# Altium schematic sheet 2-Supplies.SchDoc
size 420 x 297 mm; CompanyName: Microchip Technology Inc.; Organization: Microchip Technology; Address1: 2355 West Chandler Blvd.; Address2: Chandler, AZ  85224; Address4: USA; SheetTitle: **; Time: Time
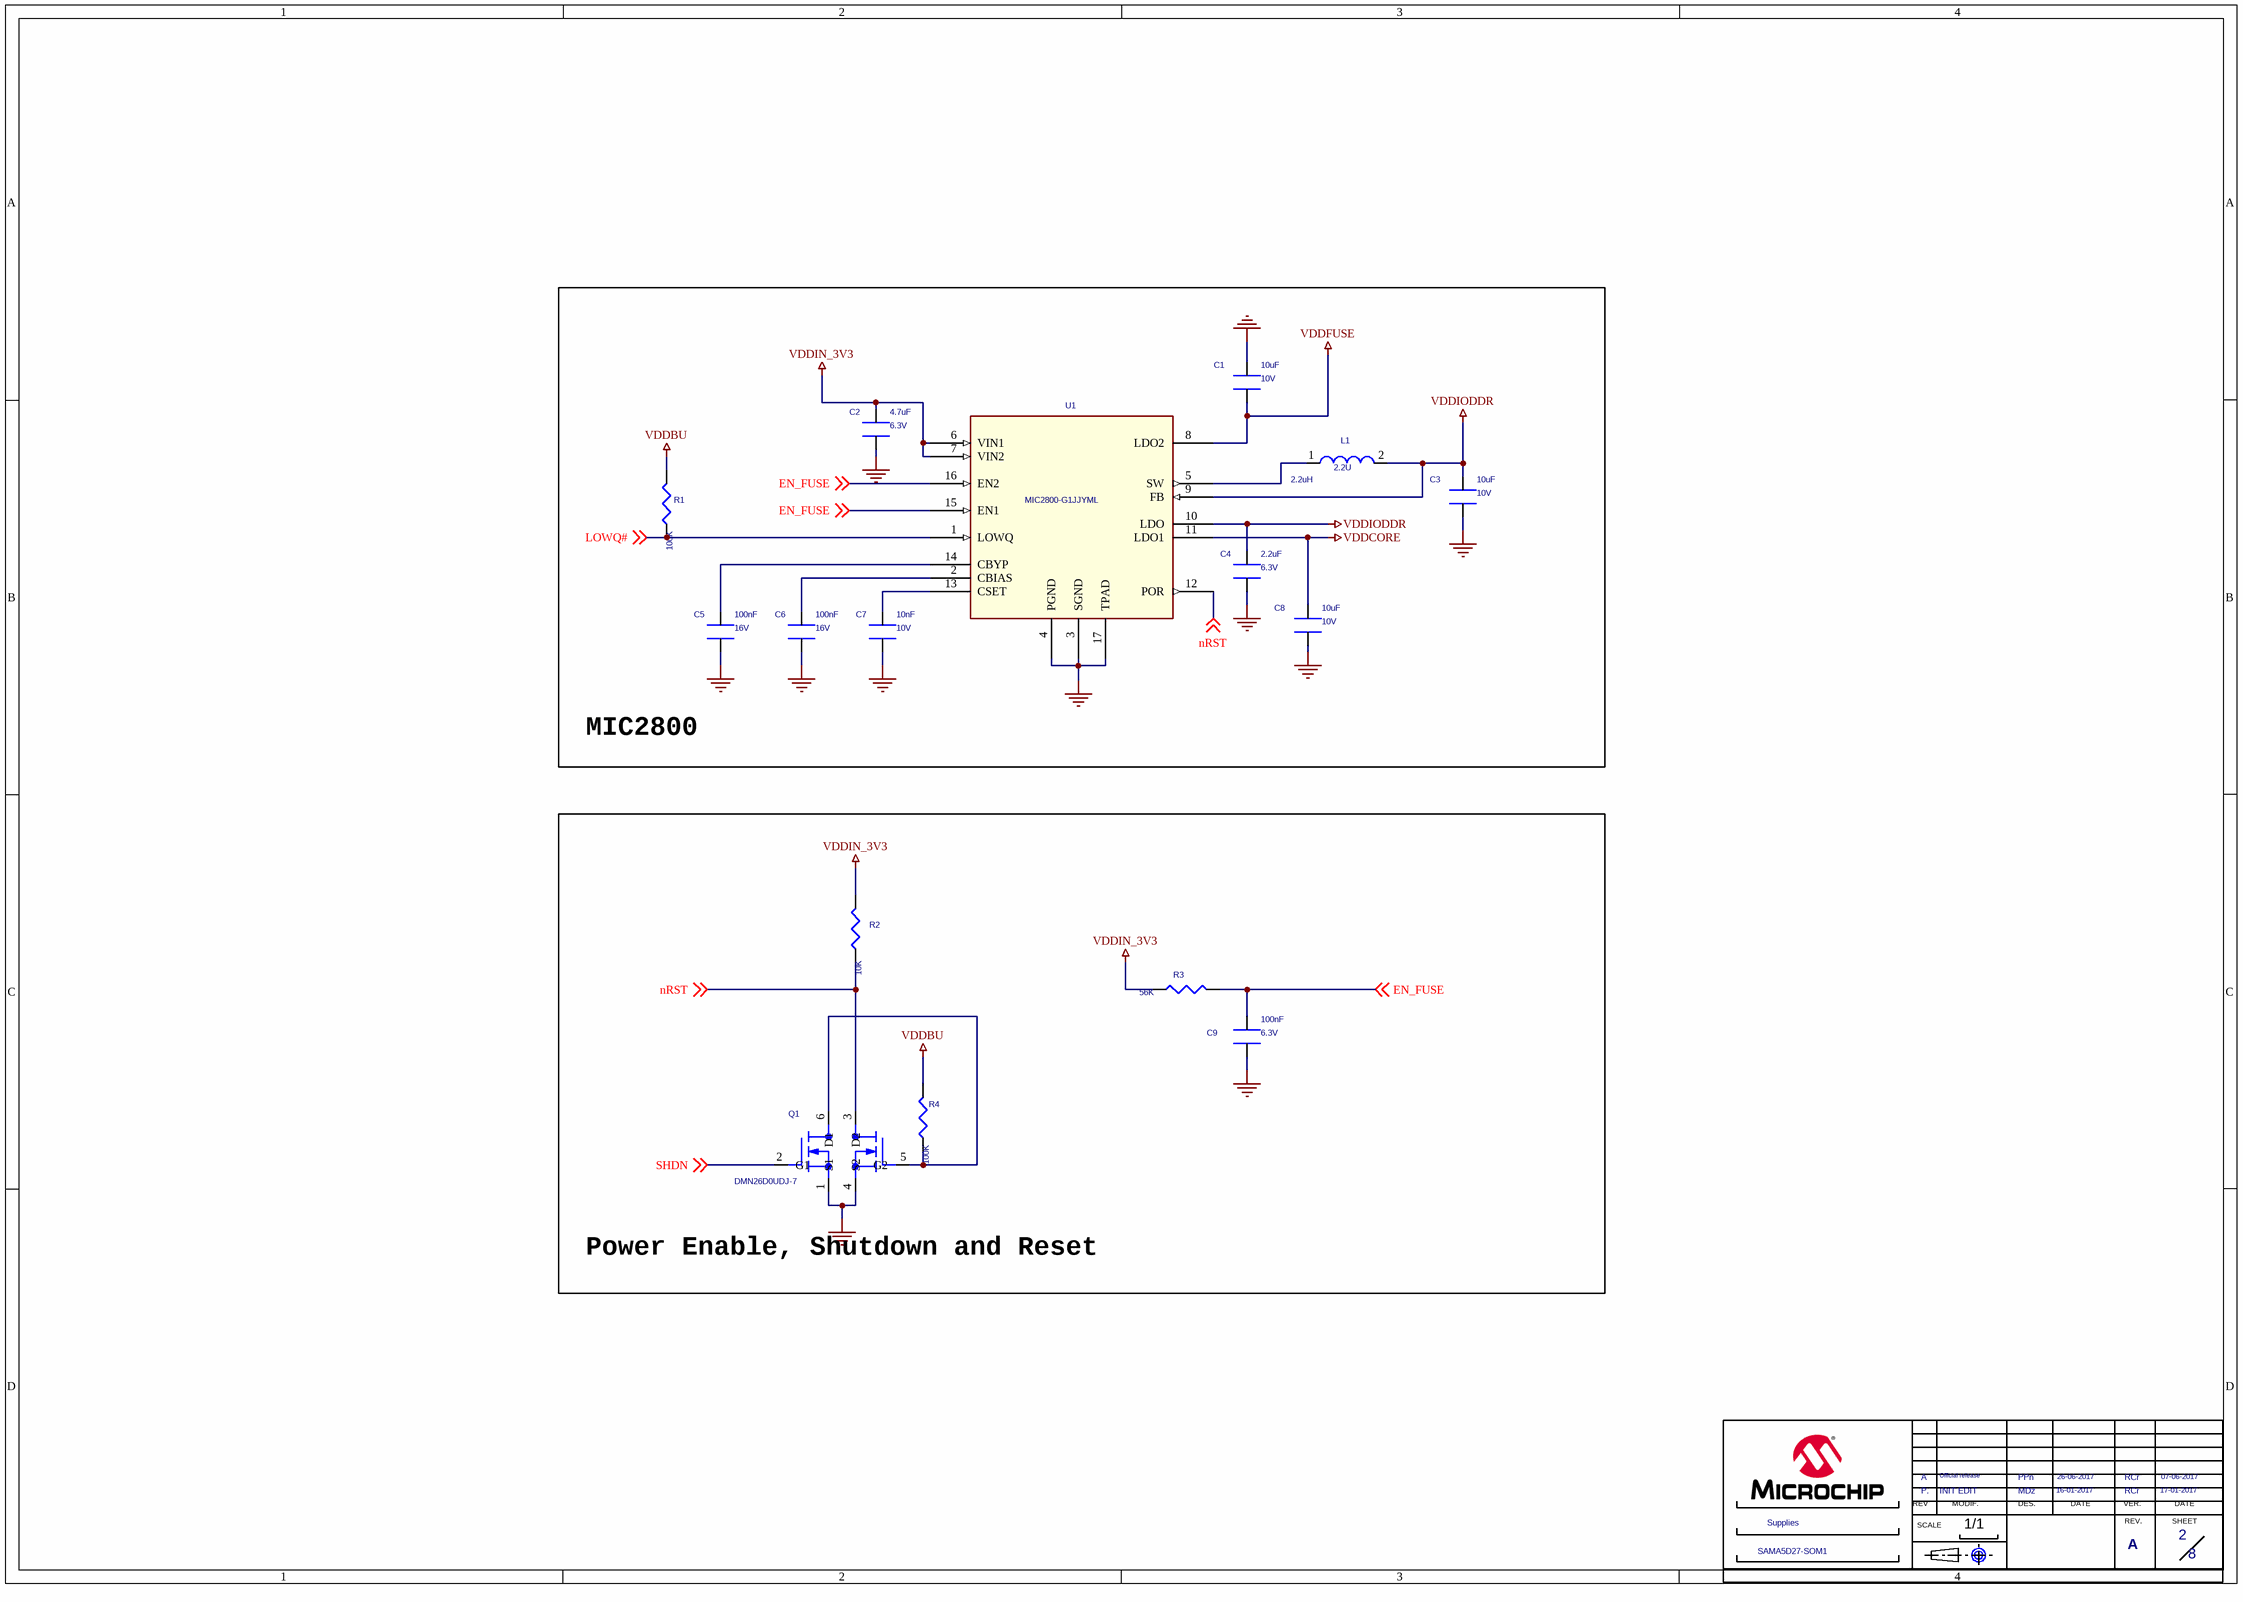
[diagram p0: 2-Supplies.SchDoc]

## Parts
*  MODIF.A: INIT EDIT  SHEET NAME 2: Supplies  SHEET NAME 1: SAMA5D27-SOM1  REV B: A  VERIF B: RCr  VERIF DATE A: 17-01-2017  VERIF DATE B: 07-06-2017  Page Count: 8  Page Number: 2  DATE A: 16-01-2017  DATE B: 26-06-2017  DES A: MDz  DES B: PPn  MODIF.B: Official release  REV A: P.  (hidden comment: CARTOUCHE MICROCHIP)  (graphical)
?  (no value)  (graphical)
C1  TENSION: 10V  VALEUR: 10uF  [C0603]  (hidden comment: xpF x% xV)
C2  TENSION: 6.3V  VALEUR: 4.7uF  [C0402]  (hidden comment: xpF x% xV)
C3  TENSION: 10V  VALEUR: 10uF  [C0603]  (hidden comment: xpF x% xV)
C4  TENSION: 6.3V  VALEUR: 2.2uF  [C0603]  (hidden comment: xpF x% xV)
C5  TENSION: 16V  VALEUR: 100nF  [C0402]  (hidden comment: xpF x% xV)
C6  TENSION: 16V  VALEUR: 100nF  [C0402]  (hidden comment: xpF x% xV)
C7  TENSION: 10V  VALEUR: 10nF  [C0201]  (hidden comment: xpF x% xV)
C8  TENSION: 10V  VALEUR: 10uF  [C0603]  (hidden comment: xpF x% xV)
C9  VALEUR: 100nF  TENSION: 6.3V  [C0201]  (hidden comment: xpF x% xV)
L1  2.2U  Valeur: 2.2uH  [L2520]
Q1  DMN26D0UDJ-7  [SOT963_01]
R1  VALEUR: 100K  [R0201]  (hidden comment: xR x% xW)
R2  VALEUR: 10K  [R0201]  (hidden comment: xR x% xW)
R3  VALEUR: 56K  [R0201]  (hidden comment: xR x% xW)
R4  VALEUR: 100K  [R0201]  (hidden comment: xR x% xW)
U1  MIC2800-G1JJYML  [QFN16_02]

## Blocks framed on the sheet
MIC2800: C1-C8 L1 R1 U1
Power Enable, Shutdown and Reset: C9 Q1 R2-R4

## Nets
GND: C1.2 C2.1 C3.1 C4.1 C5.1 C6.1 C7.1 C8.1 C9.1 Q1.1(S1) Q1.4(S2) U1.3(SGND) U1.4(PGND) U1.17(TPAD)
VDDBU: R1.2 R4.2
VDDCORE: C8.2 U1.11(LDO1)
VDDFUSE: C1.1 U1.8(LDO2)
VDDIN_3V3: C2.2 R2.2 R3.1 U1.6(VIN1) U1.7(VIN2)
VDDIODDR: C3.2 C4.2 L1.2 U1.9(FB) U1.10(LDO)
EN_FUSE: C9.2 R3.2 U1.15(EN1) U1.16(EN2) ; off-sheet EN_FUSE
LOWQ#: R1.1 U1.1(LOWQ) ; off-sheet LOWQ#
nRST: Q1.3(D2) R2.1 U1.12(POR) ; off-sheet nRST
SHDN: Q1.2(G1) ; off-sheet SHDN
NetC5_2: C5.2 U1.14(CBYP)
NetC6_2: C6.2 U1.2(CBIAS)
NetC7_2: C7.2 U1.13(CSET)
NetL1_1: L1.1 U1.5(SW)
NetQ1_5: Q1.5(G2) Q1.6(D1) R4.1

## Notes on the sheet
- Drawn By:
- Engineer:
- PartNumber:
- Project Title
- Sheet Title
- Size
- B
- Revision:
- Sch #:
- Date:
- Sheet
- Designed with
- Altium.com <http://go.altium.com/MicrochipLandingPage_Evaluation.html>
- File:
- (in symbol CARTOUCHE MICROCHIP) REV; MODIF.; DES.; DATE; VER.; SCALE; REV.; SHEET; 1/1

## Library data of the parts
* = CARTOUCHE MICROCHIP: REV D: D; REV C: C; REV F: F; REV E: E; VERIF F: XXX; VERIF DATE F: XX-XXX-XX; MODIF.C: RevC; MODIF.D: RevD; MODIF.E: RevE; MODIF.F: RevF; VERIF E: XXX; VERIF D: XXX; VERIF C: RCr; VERIF A: RCr; VERIF DATE E: XX-XXX-XX; VERIF DATE D: XX-XXX-XX; VERIF DATE C: 07-06-2017; REV: A; FT: ?; Page Size: A; Page Create Date: june 19, 2004; DATE C: 07-06-2017; DATE D: XX-XXX-XX; DATE E: XX-XXX-XX; DATE F: XX-XXX-XX; DES E: XXX; DES F: XXX; DES C: XXX; DES D: XXX
? = Title Block B
C1 C3 C8 = C0603-10uF-X5R-10V-10%: COURANT: xA; HAUTEUR: xmm; TOLERENCE: 10%; DESIGNATION: Condensateur CMS céramique; BOITIER: 0603; DIELECTRIQUE: X5R; TEMPERATURE: 40°C/+85°C
C2 = C0402-4.7uF-X5R-6.3V-10%: COURANT: xA; HAUTEUR: xmm; TOLERENCE: 10%; DESIGNATION: Condensateur CMS céramique; BOITIER: 0402; DIELECTRIQUE: X5R; TEMPERATURE: 40°C/+85°C
C4 = C0603-2.2uF-X7R-6.3V-10%: COURANT: xA; HAUTEUR: xmm; TOLERENCE: 10%; DESIGNATION: Condensateur CMS céramique; BOITIER: 0603; DIELECTRIQUE: X7R; TEMPERATURE: 40°C/+85°C
C5 C6 = C0402-100nF-X7R-16V-10%: COURANT: xA; HAUTEUR: xmm; TOLERENCE: 10%; DESIGNATION: Condensateur CMS céramique; BOITIER: 0402; DIELECTRIQUE: X7R; TEMPERATURE: 40°C/+85°C
C7 = C0201-10nF-X7R-10V: COURANT: xA; HAUTEUR: xmm; TOLERENCE: ?%; DESIGNATION: Condensateur CMS céramique; BOITIER: 0201; DIELECTRIQUE: X7R; TEMPERATURE: 40°C/+85°C
C9 = C0201-100nF-X5R-6.3V: DIELECTRIQUE: X5R; BOITIER: 0201; DESIGNATION: Condensateur CMS céramique; TOLERENCE: ?%; HAUTEUR: xmm; COURANT: xA; TEMPERATURE: 40°C/+85°C
L1 = MLP2520H2R2MT0S1: TOLERANCE: 20%; FABRICANT: TDK; type: ???; DESIGNATION: Inductance CMS; TEMPERATURE: -40°C/+125°C; partnumber: MLP2520H2R2MT0S1
Q1 = DMN26D0UDJ-7: FABRICANT: Diodes Incorporated; DESIGNATION: Mosfet dual N-CH 20V 0.23A; TEMPERATURE: -55°C/+150°C
R1 R4 = R0201-100K-5%: TENSION: xV; BOITIER: 0201; COURANT: xA; DESIGNATION: Resistance CMS; TOLERANCE: 5%; PUISSANCE: xW; TEMPERATURE: -40°C/+85°C
R2 = R0201-10K-5%: TENSION: xV; BOITIER: 0201; COURANT: xA; DESIGNATION: Resistance CMS; TOLERANCE: 5%; PUISSANCE: xW; TEMPERATURE: -40°C/+85°C
R3 = R0201-56K-5%: TOLERANCE: 5%; DESIGNATION: Resistance CMS; COURANT: xA; BOITIER: 0201; TENSION: xV; TEMPERATURE: -40°C/+85°C; PUISSANCE: xW
U1 = MIC2800-G1JJYML: FABRICANT: MICROCHIP; DESIGNATION: Linear Voltage Regulators; TEMPERATURE: -40°C/+125°C